# EAGLE design Precision LPC (EAGLE 6.2)
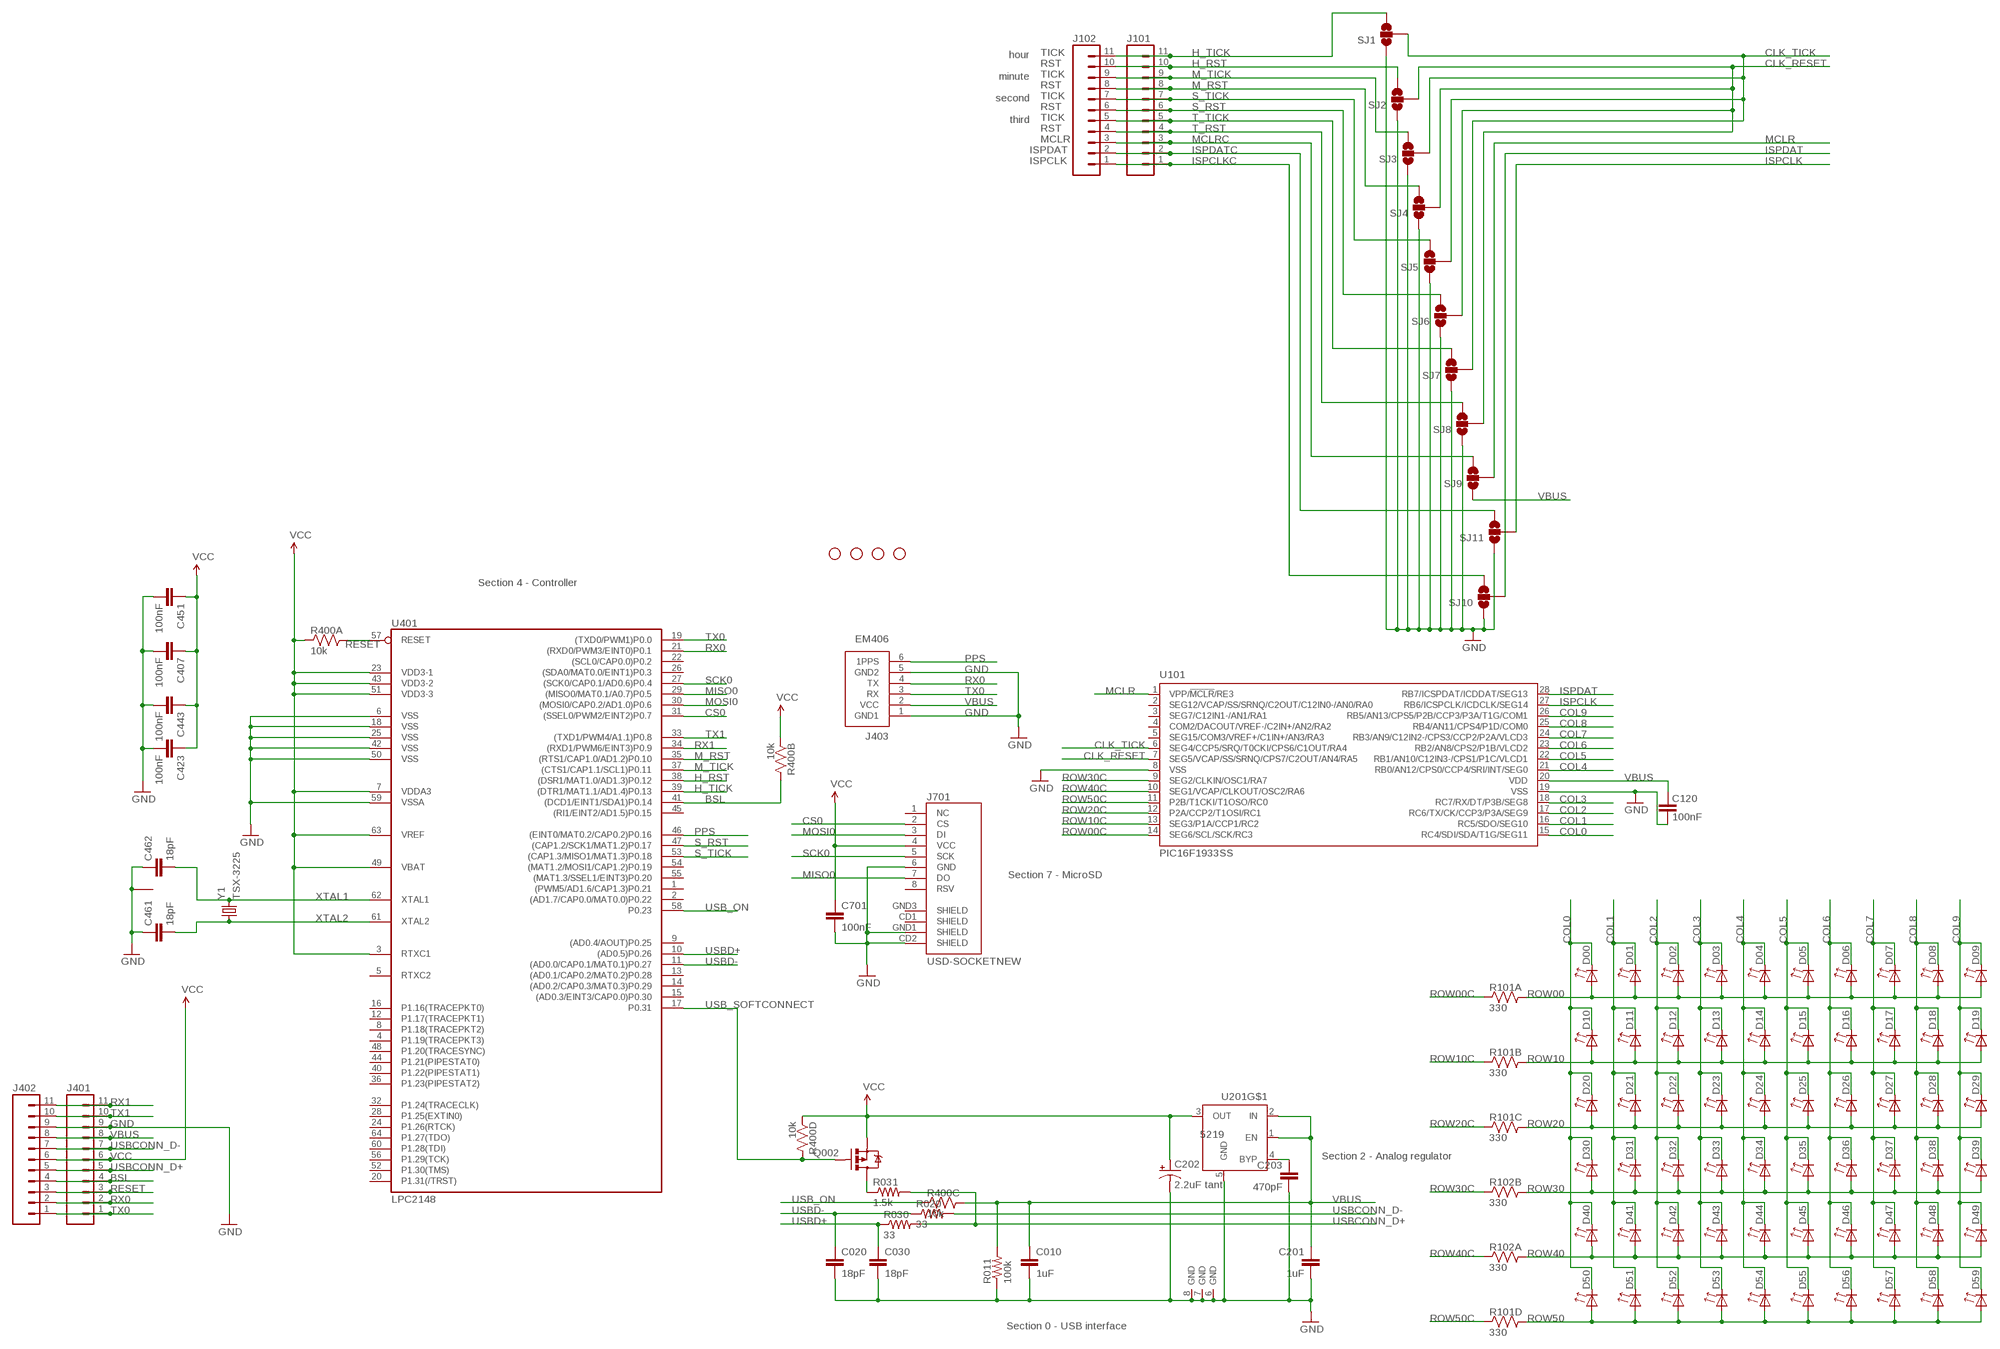
[diagram p0: schematic, sheet 1]

## Parts
C010  1uF  CAP0402-CAP  [0402-CAP]
C020  18pF  CAP0402-CAP  [0402-CAP]
C030  18pF  CAP0402-CAP  [0402-CAP]
C120  100nF  CAP0402-CAP  [0402-CAP]
C201  1uF  CAP0402-CAP  [0402-CAP]
C202  2.2uF tant  CAP_POL1206  [EIA3216]
C203  470pF  CAP0402-CAP  [0402-CAP]
C407  100nF  CAP0402-CAP  [0402-CAP]
C423  100nF  CAP0402-CAP  [0402-CAP]
C443  100nF  CAP0402-CAP  [0402-CAP]
C451  100nF  CAP0402-CAP  [0402-CAP]
C461  18pF  CAP0402-CAP  [0402-CAP]
C462  18pF  CAP0402-CAP  [0402-CAP]
C701  100nF  CAP0402-CAP  [0402-CAP]
D00  LED0603_SIDE  [LED0603_SIDE]
D01  LED0603_SIDE  [LED0603_SIDE]
D02  LED0603_SIDE  [LED0603_SIDE]
D03  LED0603_SIDE  [LED0603_SIDE]
D04  LED0603_SIDE  [LED0603_SIDE]
D05  LED0603_SIDE  [LED0603_SIDE]
D06  LED0603_SIDE  [LED0603_SIDE]
D07  LED0603_SIDE  [LED0603_SIDE]
D08  LED0603_SIDE  [LED0603_SIDE]
D09  LED0603_SIDE  [LED0603_SIDE]
D10  LED0603_SIDE  [LED0603_SIDE]
D11  LED0603_SIDE  [LED0603_SIDE]
D12  LED0603_SIDE  [LED0603_SIDE]
D13  LED0603_SIDE  [LED0603_SIDE]
D14  LED0603_SIDE  [LED0603_SIDE]
D15  LED0603_SIDE  [LED0603_SIDE]
D16  LED0603_SIDE  [LED0603_SIDE]
D17  LED0603_SIDE  [LED0603_SIDE]
D18  LED0603_SIDE  [LED0603_SIDE]
D19  LED0603_SIDE  [LED0603_SIDE]
D20  LED0603_SIDE  [LED0603_SIDE]
D21  LED0603_SIDE  [LED0603_SIDE]
D22  LED0603_SIDE  [LED0603_SIDE]
D23  LED0603_SIDE  [LED0603_SIDE]
D24  LED0603_SIDE  [LED0603_SIDE]
D25  LED0603_SIDE  [LED0603_SIDE]
D26  LED0603_SIDE  [LED0603_SIDE]
D27  LED0603_SIDE  [LED0603_SIDE]
D28  LED0603_SIDE  [LED0603_SIDE]
D29  LED0603_SIDE  [LED0603_SIDE]
D30  LED0603_SIDE  [LED0603_SIDE]
D31  LED0603_SIDE  [LED0603_SIDE]
D32  LED0603_SIDE  [LED0603_SIDE]
D33  LED0603_SIDE  [LED0603_SIDE]
D34  LED0603_SIDE  [LED0603_SIDE]
D35  LED0603_SIDE  [LED0603_SIDE]
D36  LED0603_SIDE  [LED0603_SIDE]
D37  LED0603_SIDE  [LED0603_SIDE]
D38  LED0603_SIDE  [LED0603_SIDE]
D39  LED0603_SIDE  [LED0603_SIDE]
D40  LED0603_SIDE  [LED0603_SIDE]
D41  LED0603_SIDE  [LED0603_SIDE]
D42  LED0603_SIDE  [LED0603_SIDE]
D43  LED0603_SIDE  [LED0603_SIDE]
D44  LED0603_SIDE  [LED0603_SIDE]
D45  LED0603_SIDE  [LED0603_SIDE]
D46  LED0603_SIDE  [LED0603_SIDE]
D47  LED0603_SIDE  [LED0603_SIDE]
D48  LED0603_SIDE  [LED0603_SIDE]
D49  LED0603_SIDE  [LED0603_SIDE]
D50  LED0603_SIDE  [LED0603_SIDE]
D51  LED0603_SIDE  [LED0603_SIDE]
D52  LED0603_SIDE  [LED0603_SIDE]
D53  LED0603_SIDE  [LED0603_SIDE]
D54  LED0603_SIDE  [LED0603_SIDE]
D55  LED0603_SIDE  [LED0603_SIDE]
D56  LED0603_SIDE  [LED0603_SIDE]
D57  LED0603_SIDE  [LED0603_SIDE]
D58  LED0603_SIDE  [LED0603_SIDE]
D59  LED0603_SIDE  [LED0603_SIDE]
J101  M11PTH  [1X11]
J102  M11PTH  [1X11]
J401  M11PTH  [1X11]
J402  M11PTH  [1X11]
J403  EM406  [EM406@1]
J701  USD-SOCKETNEW  [MICRO-SD-SOCKET-PP]
JP3  STAND-OFF  [STAND-OFF]
JP4  STAND-OFF  [STAND-OFF]
JP5  STAND-OFF  [STAND-OFF]
JP6  STAND-OFF  [STAND-OFF]
Q002  PMOS  MOSFET-PCHANNELSMD  [SOT23-3]
R011  100k  RESISTOR0402-RES  [0402-RES]
R020  33  RESISTOR0402-RES  [0402-RES]
R030  33  RESISTOR0402-RES  [0402-RES]
R031  1.5k  RESISTOR0402-RES  [0402-RES]
R101  330  RP404  [CRA04]
R102  330  RP404  [CRA04]
R400  10k  RP404  [CRA04]
SJ1  SOLDERJUMPER_2WAYS  [SJ_3]
SJ2  SOLDERJUMPER_2WAYS  [SJ_3]
SJ3  SOLDERJUMPER_2WAYS  [SJ_3]
SJ4  SOLDERJUMPER_2WAYS  [SJ_3]
SJ5  SOLDERJUMPER_2WAYS  [SJ_3]
SJ6  SOLDERJUMPER_2WAYS  [SJ_3]
SJ7  SOLDERJUMPER_2WAYS  [SJ_3]
SJ8  SOLDERJUMPER_2WAYS  [SJ_3]
SJ9  SOLDERJUMPER_2WAYS  [SJ_3]
SJ10  SOLDERJUMPER_2WAYS  [SJ_3]
SJ11  SOLDERJUMPER_2WAYS  [SJ_3]
U101  PIC16F1933SS  [SSOP28]
U201  5219  MIC5219FMM  [MSOP08]
U401  LPC2148  LPC213X  [SQFP-S-10X10-64]
Y1  TSX-3225  [CRYSTAL_SMD]

## Nets
BSL: J401.4 J402.4 R400.7 U401.41((DCD1/EINT1/SDA1)P0.14)
CLK_RESET: SJ2.2 SJ4.2 SJ6.2 SJ8.2 U101.7(SEG5/VCAP/SS/SRNQ/CPS7/C2OUT/AN4/RA5)
CLK_TICK: SJ1.2 SJ3.2 SJ5.2 SJ7.2 U101.6(SEG4/CCP5/SRQ/T0CKI/CPS6/C1OUT/RA4)
COL0: D00.C D10.C D20.C D30.C D40.C D50.C U101.15(RC4/SDI/SDA/T1G/SEG11)
COL1: D01.C D11.C D21.C D31.C D41.C D51.C U101.16(RC5/SDO/SEG10)
COL2: D02.C D12.C D22.C D32.C D42.C D52.C U101.17(RC6/TX/CK/CCP3/P3A/SEG9)
COL3: D03.C D13.C D23.C D33.C D43.C D53.C U101.18(RC7/RX/DT/P3B/SEG8)
COL4: D04.C D14.C D24.C D34.C D44.C D54.C U101.21(RB0/AN12/CPS0/CCP4/SRI/INT/SEG0)
COL5: D05.C D15.C D25.C D35.C D45.C D55.C U101.22(RB1/AN10/C12IN3-/CPS1/P1C/VLCD1)
COL6: D06.C D16.C D26.C D36.C D46.C D56.C U101.23(RB2/AN8/CPS2/P1B/VLCD2)
COL7: D07.C D17.C D27.C D37.C D47.C D57.C U101.24(RB3/AN9/C12IN2-/CPS3/CCP2/P2A/VLCD3)
COL8: D08.C D18.C D28.C D38.C D48.C D58.C U101.25(RB4/AN11/CPS4/P1D/COM0)
COL9: D09.C D19.C D29.C D39.C D49.C D59.C U101.26(RB5/AN13/CPS5/P2B/CCP3/P3A/T1G/COM1)
CS0: J701.2(CS) U401.31((SSEL0/PWM2/EINT2)P0.7)
GND [power]: C010.2 C020.2 C030.2 C120.1 C201.2 C202.C(-) C203.2 C407.2 C423.2 C443.2 C451.2 C461.1 C462.1 C701.2 J401.9 J402.9 J403.1(GND1) J403.5(GND2) J701.6(GND) J701.CD2(SHIELD) J701.GND1(SHIELD) R011.1 SJ1.1 SJ2.1 SJ3.1 SJ4.1 SJ5.1 SJ6.1 SJ7.1 SJ8.1 SJ10.1 SJ11.1 U101.8(VSS) U101.19(VSS) U201.5(GND) U201.6(GND) U201.7(GND) U201.8(GND) U401.6(VSS) U401.18(VSS) U401.25(VSS) U401.42(VSS) U401.50(VSS) U401.59(VSSA) Y1.2 Y1.4
H_RST: J101.10 J102.10 SJ2.3 U401.38((DSR1/MAT1.0/AD1.3)P0.12)
H_TICK: J101.11 J102.11 SJ1.3 U401.39((DTR1/MAT1.1/AD1.4)P0.13)
ISPCLK: SJ11.2 U101.27(RB6/ICSPCLK/ICDCLK/SEG14)
ISPCLKC: J101.2 J102.2 SJ11.3
ISPDAT: SJ10.2 U101.28(RB7/ICSPDAT/ICDDAT/SEG13)
ISPDATC: J101.1 J102.1 SJ10.3
M_RST: J101.8 J102.8 SJ4.3 U401.35((RTS1/CAP1.0/AD1.2)P0.10)
M_TICK: J101.9 J102.9 SJ3.3 U401.37((CTS1/CAP1.1/SCL1)P0.11)
MCLR: SJ9.2 U101.1(VPP/!MCLR!/RE3)
MCLRC: J101.3 J102.3 SJ9.3
MISO0: J701.7(DO) U401.29((MISO0/MAT0.1/A0.7)P0.5)
MOSI0: J701.3(DI) U401.30((MOSI0/CAP0.2/AD1.0)P0.6)
N$3: C203.1 U201.4(BYP)
PPS: J403.6(1PPS) U401.46((EINT0/MAT0.2/CAP0.2)P0.16)
QDRAIN: Q002.3(D) R031.1
RESET: J401.3 J402.3 R400.8 U401.57(RESET)
ROW00: D00.A D01.A D02.A D03.A D04.A D05.A D06.A D07.A D08.A D09.A R101.8
ROW00C: R101.1 U101.14(SEG6/SCL/SCK/RC3)
ROW10: D10.A D11.A D12.A D13.A D14.A D15.A D16.A D17.A D18.A D19.A R101.7
ROW10C: R101.2 U101.13(SEG3/P1A/CCP1/RC2)
ROW20: D20.A D21.A D22.A D23.A D24.A D25.A D26.A D27.A D28.A D29.A R101.6
ROW20C: R101.3 U101.12(P2A/CCP2/T1OSI/RC1)
ROW30: D30.A D31.A D32.A D33.A D34.A D35.A D36.A D37.A D38.A D39.A R102.7
ROW30C: R102.2 U101.9(SEG2/CLKIN/OSC1/RA7)
ROW40: D40.A D41.A D42.A D43.A D44.A D45.A D46.A D47.A D48.A D49.A R102.8
ROW40C: R102.1 U101.10(SEG1/VCAP/CLKOUT/OSC2/RA6)
ROW50: D50.A D51.A D52.A D53.A D54.A D55.A D56.A D57.A D58.A D59.A R101.5
ROW50C: R101.4 U101.11(P2B/T1CKI/T1OSO/RC0)
RX0: J401.2 J402.2 J403.4(TX) U401.21((RXD0/PWM3/EINT0)P0.1)
RX1: J401.11 J402.11 U401.34((RXD1/PWM6/EINT3)P0.9)
S_RST: J101.6 J102.6 SJ6.3 U401.47((CAP1.2/SCK1/MAT1.2)P0.17)
S_TICK: J101.7 J102.7 SJ5.3 U401.53((CAP1.3/MISO1/MAT1.3)P0.18)
SCK0: J701.5(SCK) U401.27((SCK0/CAP0.1/AD0.6)P0.4)
T_RST: J101.4 J102.4 SJ8.3
T_TICK: J101.5 J102.5 SJ7.3
TX0: J401.1 J402.1 J403.3(RX) U401.19((TXD0/PWM1)P0.0)
TX1: J401.10 J402.10 U401.33((TXD1/PWM4/A1.1)P0.8)
USB_ON: R400.3 U401.58(P0.23)
USB_SOFTCONNECT: Q002.1(G) R400.5 U401.17(P0.31)
USBCONN_D+: J401.5 J402.5 R030.2 R031.2
USBCONN_D-: J401.7 J402.7 R020.2
USBD+: C030.1 R030.1 U401.10((AD0.5)P0.26)
USBD-: C020.1 R020.1 U401.11((AD0.0/CAP0.1/MAT0.1)P0.27)
VBUS: C010.1 C120.2 C201.1 J401.8 J402.8 J403.2(VCC) R011.2 R400.6 SJ9.1 U101.20(VDD) U201.1(EN) U201.2(IN)
VCC [power]: C202.A(+) C407.1 C423.1 C443.1 C451.1 C701.1 J401.6 J402.6 J701.4(VCC) Q002.2(S) R400.1 R400.2 R400.4 U201.3(OUT) U401.3(RTXC1) U401.7(VDDA3) U401.23(VDD3-1) U401.43(VDD3-2) U401.49(VBAT) U401.51(VDD3-3) U401.63(VREF)
XTAL1: C462.2 U401.62(XTAL1) Y1.3
XTAL2: C461.2 U401.61(XTAL2) Y1.1
Unconnected: J701.1(NC) J701.8(RSV) J701.CD1(SHIELD) J701.GND3(SHIELD) R102.3 R102.4 R102.5 R102.6 U101.2(SEG12/VCAP/SS/SRNQ/C2OUT/C12IN0-/AN0/RA0) U101.3(SEG7/C12IN1-/AN1/RA1) U101.4(COM2/DACOUT/VREF-/C2IN+/AN2/RA2) U101.5(SEG15/COM3/VREF+/C1IN+/AN3/RA3) U401.1((PWM5/AD1.6/CAP1.3)P0.21) U401.2((AD1.7/CAP0.0/MAT0.0)P0.22) U401.4(P1.19(TRACEPKT3)) U401.5(RTXC2) U401.8(P1.18(TRACEPKT2)) U401.9((AD0.4/AOUT)P0.25) U401.12(P1.17(TRACEPKT1)) U401.13((AD0.1/CAP0.2/MAT0.2)P0.28) U401.14((AD0.2/CAP0.3/MAT0.3)P0.29) U401.15((AD0.3/EINT3/CAP0.0)P0.30) U401.16(P1.16(TRACEPKT0)) U401.20(P1.31(/TRST)) U401.22((SCL0/CAP0.0)P0.2) U401.24(P1.26(RTCK)) U401.26((SDA0/MAT0.0/EINT1)P0.3) U401.28(P1.25(EXTIN0)) U401.32(P1.24(TRACECLK)) U401.36(P1.23(PIPESTAT2)) U401.40(P1.22(PIPESTAT1)) U401.44(P1.21(PIPESTAT0)) U401.45((RI1/EINT2/AD1.5)P0.15) U401.48(P1.20(TRACESYNC)) U401.52(P1.30(TMS)) U401.54((MAT1.2/MOSI1/CAP1.2)P0.19) U401.55((MAT1.3/SSEL1/EINT3)P0.20) U401.56(P1.29(TCK)) U401.60(P1.28(TDI)) U401.64(P1.27(TDO))

## Notes on the sheet
- hour
- TICK
- RST
- minute
- TICK
- RST
- second
- TICK
- RST
- third
- TICK
- RST
- MCLR
- ISPDAT
- ISPCLK
- Section 4 - Controller
- Section 7 - MicroSD
- Section 2 - Analog regulator
- Section 0 - USB interface

## Library data of the parts
C010 C020 C030 C120 C201 C203 C407 C423 C443 C451 C461 C462 C701 = SparkFun:CAP: Capacitor Standard 0603 ceramic capacitor, and 0.1" leaded capacitor.
C202 = SparkFun:CAP_POL: Capacitor Polarized These are standard SMD and PTH capacitors. Normally 10uF, 47uF, and 100uF in electrolytic and tantalum varieties. Always verify the external diameter of the through hole cap, it varies with capacity, voltage, and manufacturer. The EIA devices should be standard.
D00 D01-D09 D10-D59 = KwanSystems:LED0603_SIDE
J101 J102 J401 J402 = SparkFun:M11: Header 11 Standard 11-pin 0.1" header. Use with straight break away headers (SKU : PRT-00116), right angle break away headers (PRT-00553), swiss pins (PRT-00743), machine pins (PRT-00117), and female headers (PRT-00115).
J403 = SparkFun:EM406: EM406 Connector Proven layout and schematic for EM406 connector. Spark Fun Electronics SKU : GPS-00579
J701 = SparkFun:USD-SOCKET: microSD Socket Push-push type uSD socket. Schematic element and footprint production proven. Spark Fun Electronics SKU : PRT-00127. tDoc lines correctly indicate media card edge positions when inserting (unlocked, locked, depressed).
JP3-JP6 = SparkFun:STAND-OFF: Stand Off This is the mechanical footprint for a #4 phillips button head screw. Use the keepout ring to avoid running the screw head into surrounding components. SKU : PRT-00447
Q002 = SparkFun:MOSFET-PCHANNEL
R011 R020 R030 R031 = SparkFun:RESISTOR: Resistor Basic schematic elements and footprints for 0603, 1206, and PTH resistors.
R101 R102 R400 = KwanSystems:RP4
SJ1-SJ11 = SparkFun:SOLDERJUMPER_2WAY: Solder Jumper 2 way solder jumper
U101 = microchip:PIC16F19*: Flash-Based, 8-Bit CMOS Microcontrollers wtih LCD Driver and nanoWatt XLP Technology Auto generated by make-symbol-device-package-bsdl.ulp Rev. 33 Source: http://ww1.microchip.com/downloads/en/DeviceDoc/41364D.pdf; MPN: PIC16F1933T-I/SS; OC_FARNELL: 1755815; OC_NEWARK: 08R1942
U201 = v-reg-micrel:MIC5219FMM: VOLTAGE REGULATOR; OC_FARNELL: unknown; OC_NEWARK: unknown
U401 = SparkFun:LPC213X: LPC213x Schematic element and footprint for NXP LPC213x. Spark Fun Electronics SKU : COM-00520
Y1 = KwanSystems:TSX-3225

## Net classes
0 default: width 0.152 mm, drill 0.33 mm, clearance 0.152 mm
1 power: width 0.152 mm, drill 0.33 mm, clearance 0.152 mm
2 hv: width 0.152 mm, drill 0.33 mm, clearance 0.152 mm

## Board
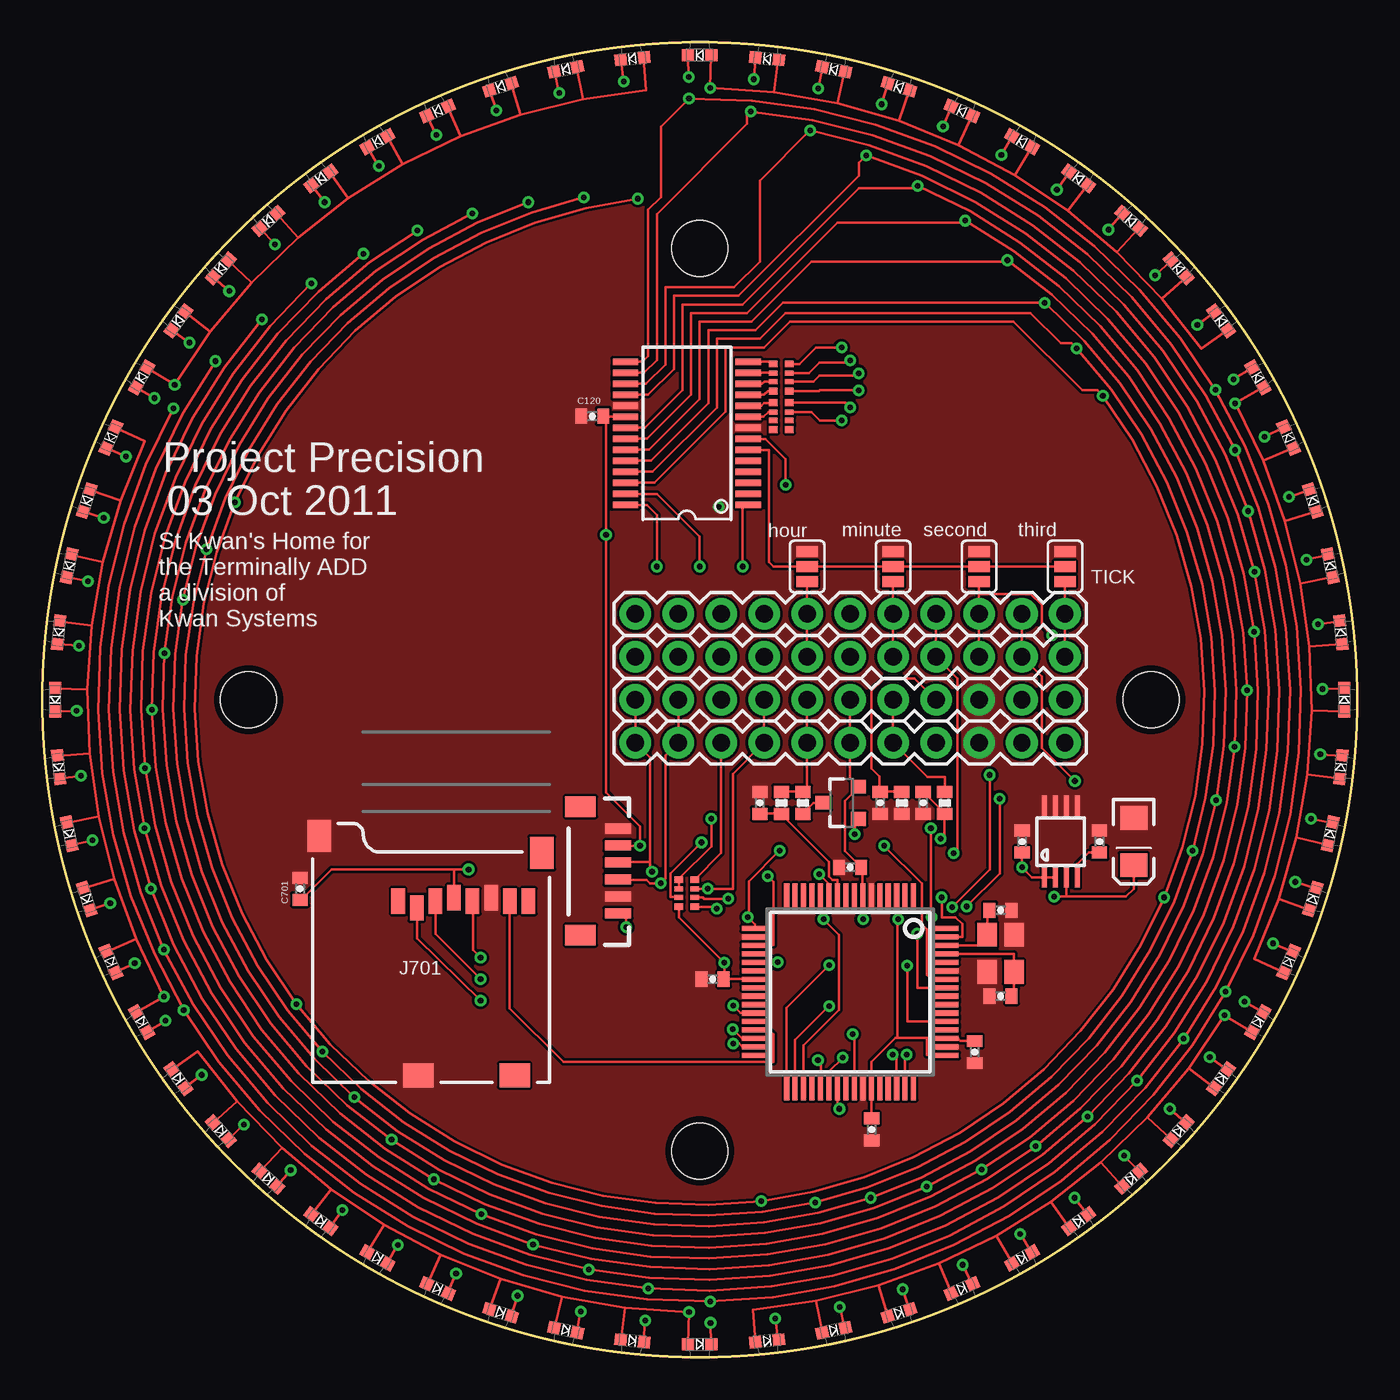
[diagram p1: board, top side]
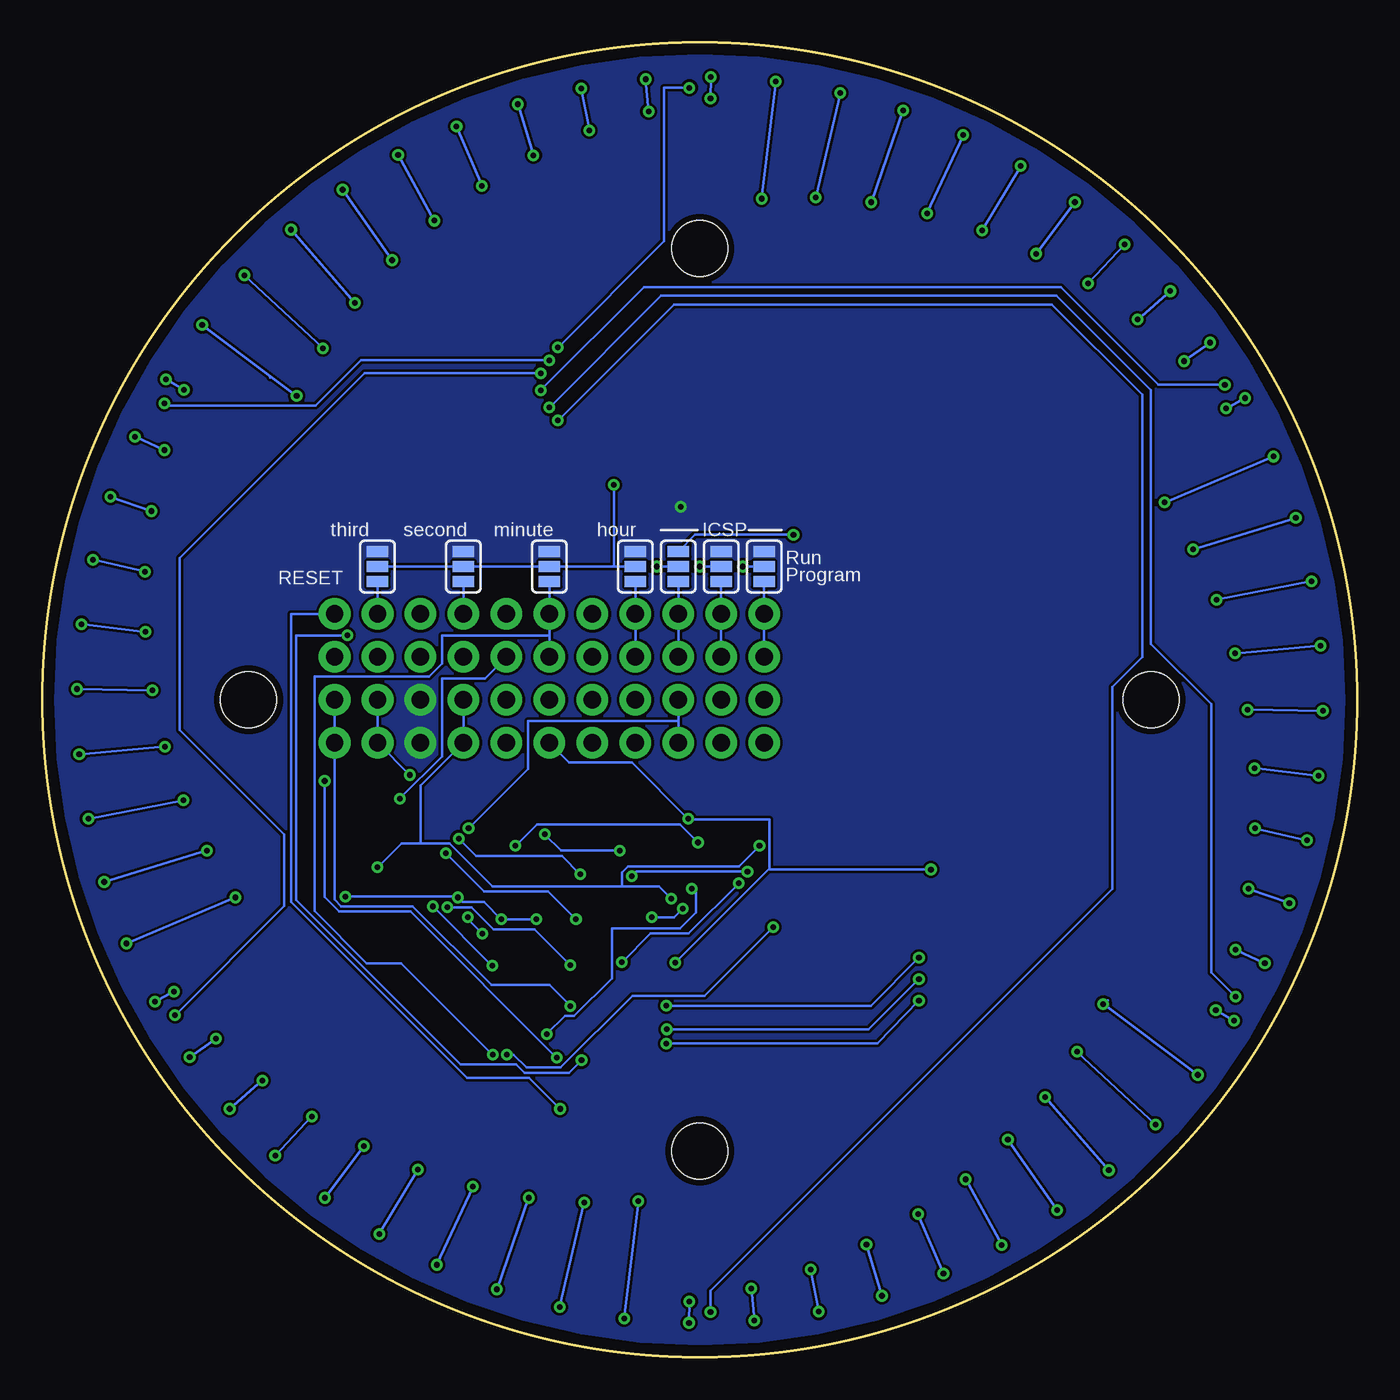
[diagram p2: board, bottom side, seen from below]

Size 77.72 x 77.72 mm. Coordinates in mm from the lower left corner, seen from the top.
Outline: circle at 38.86,38.86 radius 38.86
Copper layers (1*16): Top 0.0356mm / dielectric 1.5011mm / Bottom 0.0356mm
Design rules "LaenPCBOrder *": minimum track width 6mil, minimum drill 13mil, track to track 6mil, track to pad 6mil, pad to pad 6mil, via to via 6mil, smd to smd 6mil, copper to edge 15mil, drill to drill 6mil, minimum pad ring 7mil, minimum via ring 7mil, stop-mask expansion 4mil, vias tented up to drill 20mil, thermal gap 10mil

### Footprints (pad centres in the part's own frame; a part is rotated, then mirrored left to right if it is on the bottom)
0402-CAP = smd 0.7 x 0.9: 1 -0.65,0; 2 0.65,0
EIA3216 = smd 1.4 x 1.6: A 1.4,0; C -1.4,0
LED0603_SIDE = smd 0.7 x 0.7: A -0.7,0; C 0.7,0
1X11 = drill 1.016 pad 1.88 round: 1 0,0; 2 2.54,0; 3 5.08,0; 4 7.62,0; 5 10.16,0; 6 12.7,0; 7 15.24,0; 8 17.78,0; 9 20.32,0; 10 22.86,0; 11 25.4,0
EM406@1 = smd 0.6 x 1.55: 1 0,0; 2 1,0; 3 2,0; 4 3,0; 5 4,0; 6 5,0 | smd 1.2 x 1.8: P$1 -1.3,-2.225; P$2 6.3,-2.225
MICRO-SD-SOCKET-PP = smd 0.8 x 1.5: 1 -8.94,10.7; 2 -7.84,10.3; 3 -6.74,10.7; 4 -5.64,10.9; 5 -4.54,10.7; 6 -3.44,10.9; 7 -2.34,10.7; 8 -1.24,10.7 | smd 1.8 x 1.4: CD1 -2.05,0.4; CD2 -7.75,0.4 | smd 1.4 x 1.9: GND1 -13.6,14.55; GND3 -0.45,13.55
STAND-OFF = hole 3.302: 0,0
SOT23-3 = smd 0.8 x 0.9: 1 -0.95,-1; 2 0.95,-1; 3 0,1.1
0402-RES = smd 0.7 x 0.9: 1 -0.65,0; 2 0.65,0
CRA04 = smd 0.4 x 0.5: 1 -0.8,-0.475; 4 0.8,-0.475; 5 0.8,0.475; 8 -0.8,0.475 | smd 0.3 x 0.5: 2 -0.25,-0.475; 3 0.25,-0.475; 6 0.25,0.475; 7 -0.25,0.475
SJ_3 = smd 0.635 x 1.27: 1 -0.889,0; 2 0,0; 3 0.889,0
SSOP28 = smd 0.4 x 1.5: 1 -4.225,-3.625; 2 -3.575,-3.625; 3 -2.925,-3.625; 4 -2.275,-3.625; 5 -1.625,-3.625; 6 -0.975,-3.625; 7 -0.325,-3.625; 8 0.325,-3.625; 9 0.975,-3.625; 10 1.625,-3.625; 11 2.275,-3.625; 12 2.925,-3.625; 13 3.575,-3.625; 14 4.225,-3.625; 15 4.225,3.625; 16 3.575,3.625; 17 2.925,3.625; 18 2.275,3.625; 19 1.625,3.625; 20 0.975,3.625; 21 0.325,3.625; 22 -0.325,3.625; 23 -0.975,3.625; 24 -1.625,3.625; 25 -2.275,3.625; 26 -2.925,3.625; 27 -3.575,3.625; 28 -4.225,3.625
MSOP08 = smd 0.3 x 1.2: 1 -0.976,-2.113; 2 -0.326,-2.113; 3 0.324,-2.113; 4 0.974,-2.113; 5 0.974,2.112; 6 0.324,2.112; 7 -0.326,2.112; 8 -0.976,2.112
SQFP-S-10X10-64 = smd 0.3 x 1.6: 1 -3.75,-5.6; 2 -3.25,-5.6; 3 -2.75,-5.6; 4 -2.25,-5.6; 5 -1.75,-5.6; 6 -1.25,-5.6; 7 -0.75,-5.6; 8 -0.25,-5.6; 9 0.25,-5.6; 10 0.75,-5.6; 11 1.25,-5.6; 12 1.75,-5.6; 13 2.25,-5.6; 14 2.75,-5.6; 15 3.25,-5.6; 16 3.75,-5.6; 33 3.75,5.6; 34 3.25,5.6; 35 2.75,5.6; 36 2.25,5.6; 37 1.75,5.6; 38 1.25,5.6; 39 0.75,5.6; 40 0.25,5.6; 41 -0.25,5.6; 42 -0.75,5.6; 43 -1.25,5.6; 44 -1.75,5.6; 45 -2.25,5.6; 46 -2.75,5.6; 47 -3.25,5.6; 48 -3.75,5.6 | smd 1.6 x 0.3: 17 5.6,-3.75; 18 5.6,-3.25; 19 5.6,-2.75; 20 5.6,-2.25; 21 5.6,-1.75; 22 5.6,-1.25; 23 5.6,-0.75; 24 5.6,-0.25; 25 5.6,0.25; 26 5.6,0.75; 27 5.6,1.25; 28 5.6,1.75; 29 5.6,2.25; 30 5.6,2.75; 31 5.6,3.25; 32 5.6,3.75; 49 -5.6,3.75; 50 -5.6,3.25; 51 -5.6,2.75; 52 -5.6,2.25; 53 -5.6,1.75; 54 -5.6,1.25; 55 -5.6,0.75; 56 -5.6,0.25; 57 -5.6,-0.25; 58 -5.6,-0.75; 59 -5.6,-1.25; 60 -5.6,-1.75; 61 -5.6,-2.25; 62 -5.6,-2.75; 63 -5.6,-3.25; 64 -5.6,-3.75
CRYSTAL_SMD = smd 1.4 x 1.15: 1 -1.1,-0.8; 2 1.1,-0.8; 3 1.1,0.8; 4 -1.1,0.8

### Placement (x,y rotation side)
C010  49.53,32.77 270 top
C020  52.07,32.77 270 top
C030  42.42,32.77 90 top
C120  32.51,55.63 0 top
C201  57.91,30.48 90 top
C202  64.52,30.48 270 top
C203  62.48,30.48 90 top
C407  47.75,28.96 180 top
C423  39.62,22.35 180 top
C443  49.02,13.46 270 top
C451  55.12,18.03 270 top
C461  56.64,21.34 0 top
C462  56.64,26.42 180 top
C701  15.24,27.69 90 top
D00  38.86,76.96 180 top
D01  42.84,76.75 174 top
D02  46.78,76.13 168 top
D03  50.63,75.1 162 top
D04  54.36,73.67 156 top
D05  57.91,71.86 150 top
D06  61.26,69.68 144 top
D07  64.36,67.18 138 top
D08  67.18,64.36 132 top
D09  69.68,61.26 126 top
D10  71.86,57.91 120 top
D11  73.67,54.36 114 top
D12  75.1,50.63 108 top
D13  76.13,46.78 102 top
D14  76.75,42.84 96 top
D15  76.96,38.86 90 top
D16  76.75,34.88 84 top
D17  76.13,30.94 78 top
D18  75.1,27.09 72 top
D19  73.67,23.37 66 top
D20  71.86,19.81 60 top
D21  69.68,16.47 54 top
D22  67.18,13.37 48 top
D23  64.36,10.55 42 top
D24  61.26,8.04 36 top
D25  57.91,5.87 30 top
D26  54.36,4.06 24 top
D27  50.63,2.63 18 top
D28  46.78,1.6 12 top
D29  42.84,0.97 6 top
D30  38.86,0.76 0 top
D31  34.88,0.97 354 top
D32  30.94,1.6 348 top
D33  27.09,2.63 342 top
D34  23.37,4.06 336 top
D35  19.81,5.87 330 top
D36  16.47,8.04 324 top
D37  13.37,10.55 318 top
D38  10.55,13.37 312 top
D39  8.04,16.47 306 top
D40  5.87,19.81 300 top
D41  4.06,23.37 294 top
D42  2.63,27.09 288 top
D43  1.6,30.94 282 top
D44  0.97,34.88 276 top
D45  0.76,38.86 270 top
D46  0.97,42.84 264 top
D47  1.6,46.78 258 top
D48  2.63,50.63 252 top
D49  4.06,54.36 246 top
D50  5.87,57.91 240 top
D51  8.04,61.26 234 top
D52  10.55,64.36 228 top
D53  13.37,67.18 222 top
D54  16.47,69.68 216 top
D55  19.81,71.86 210 top
D56  23.37,73.67 204 top
D57  27.09,75.1 198 top
D58  30.94,76.13 192 top
D59  34.88,76.75 186 top
J101  35.05,43.94 0 top
J102  35.05,41.4 0 top
J401  35.05,36.32 0 top
J402  35.05,38.86 0 top
J403  34.04,31.24 270 top
J701  29.97,16.26 0 top
JP3  65.53,38.86 0 top
JP4  38.86,65.53 0 top
JP5  12.19,38.86 0 top
JP6  38.86,12.19 0 top
Q002  47.24,32.77 90 top
R011  50.8,32.77 90 top
R020  53.34,32.77 90 top
R030  43.69,32.77 90 top
R031  44.96,32.77 90 top
R101  43.69,57.91 270 top
R102  43.69,55.63 270 top
R400  38.1,27.43 270 top
SJ1  60.45,46.74 270 top
SJ2  57.91,46.74 270 bottom
SJ3  55.37,46.74 270 top
SJ4  52.83,46.74 270 bottom
SJ5  50.29,46.74 270 top
SJ6  47.75,46.74 270 bottom
SJ7  45.21,46.74 270 top
SJ8  42.67,46.74 270 bottom
SJ9  40.13,46.74 270 bottom
SJ10  35.05,46.74 270 bottom
SJ11  37.59,46.74 270 bottom
U101  38.1,54.61 90 top
U201  60.2,30.48 0 top
U401  47.75,21.59 180 top
Y1  56.64,23.88 90 top

### Tracks (layer width: path | path; a pad name or v marks a point on that pad's centre or on a via)
BSL  (via drill 0.33)
  Top 0.152: R400.7 v39.34,27.69 40.82,27.69 40.82,34.47 J401.4 J402.4 | 47.98,16 U401.41 48,19 v47.9,19.1
  Bottom 0.152: v47.9,19.1 46.84,20.17 46.28,20.17 44.04,22.4 44.04,25.35 40.03,25.35 39.09,26.29 39.09,27.69 v39.34,27.69
CLK_RESET  (via drill 0.33)
  Top 0.152: U101.7 42.75,54.28 43.94,53.09 v43.94,51.56
  Bottom 0.152: SJ2.2 SJ4.2 SJ6.2 43.94,46.74 | SJ8.2 43.94,46.74 | 43.94,46.74 v43.94,51.56
CLK_TICK
  Top 0.152: SJ1.2 SJ3.2 50.8,46.74 50.75,46.79 50.34,46.79 SJ5.2 SJ7.2 43.2,46.74 42.95,46.99 42.95,53.62 41.73,53.62 U101.6
COL0  (via drill 0.33)
  Top 0.152: v38.2,75.67 38.18,76.94 38.18,76.96 D00.C | v70.41,57.81 71.5,58.47 71.53,58.52 D10.C | v71.07,21.01 72.16,20.37 D20.C | v39.5,2.03 39.52,0.76 D30.C | 6.21,19.23 v7.29,19.89 | 6.21,19.23 6.2,19.23 | v7.75,56.08 6.12,52.76 4.85,49.25 3.94,45.64 3.43,41.96 3.3,38.23 3.56,34.52 4.19,30.86 5.23,27.28 6.63,23.83 v8.36,20.52 10.44,17.45 12.85,14.61 15.52,12.01 18.44,9.73 21.62,7.75 24.94,6.12 28.45,4.85 32.05,3.94 35.74,3.43 v39.47,3.3 43.18,3.56 46.84,4.19 50.42,5.23 53.87,6.63 57.18,8.36 60.25,10.44 63.09,12.85 65.68,15.52 67.97,18.44 v69.95,21.62 71.58,24.94 72.85,28.45 73.76,32.05 74.27,35.74 74.4,39.47 74.14,43.18 73.51,46.84 72.47,50.42 71.07,53.87 v69.34,57.18 67.26,60.25 64.85,63.09 62.18,65.68 59.26,67.97 56.08,69.95 52.76,71.58 49.25,72.85 45.64,73.76 41.96,74.27 v38.23,74.4 36.58,72.75 36.58,68.58 35.81,67.82 35.81,59.18 35.47,58.84 U101.15 | v6.63,56.69 5.55,57.32 | 5.55,57.32 5.54,57.33 | D40.C 6.21,19.23 | D50.C 5.54,57.3 5.55,57.32
  Bottom 0.152: v38.23,74.4 v38.2,75.67 | v69.34,57.18 v70.41,57.81 | v69.95,21.62 v71.07,21.01 | v39.47,3.3 v39.5,2.03 | v7.29,19.89 v8.36,20.52 | v7.75,56.08 v6.63,56.69
COL1  (via drill 0.33)
  Top 0.152: v42.06,75.54 42.16,76.81 42.16,76.84 D01.C | v72.24,54.41 73.38,54.94 73.41,54.99 D11.C | v69.01,17.73 70.05,16.99 70.1,17.04 D21.C | v35.64,2.16 35.54,0.92 | 35.54,0.92 35.54,0.89 | 4.33,22.76 v5.46,23.29 | 4.33,22.76 4.32,22.76 | v10.24,58.88 8.31,55.78 6.71,52.5 5.46,49.07 4.57,45.52 4.06,41.88 3.94,38.25 4.19,34.59 4.83,30.99 5.82,27.48 v7.19,24.08 8.92,20.85 10.95,17.83 13.31,15.04 15.93,12.5 18.82,10.24 21.92,8.31 25.2,6.71 28.63,5.46 32.18,4.57 v35.81,4.06 39.45,3.94 43.1,4.19 46.71,4.83 50.22,5.82 53.62,7.19 56.84,8.92 59.87,10.95 62.66,13.31 65.2,15.93 v67.46,18.82 69.39,21.92 70.99,25.2 72.24,28.63 73.13,32.18 73.63,35.81 73.76,39.45 73.51,43.1 72.87,46.71 71.88,50.22 v70.51,53.62 68.78,56.84 66.75,59.87 64.39,62.66 61.77,65.2 58.88,67.46 55.78,69.39 52.5,70.99 49.07,72.24 45.52,73.13 v41.88,73.63 41.66,73.41 41.66,72.9 36.32,67.56 36.32,58.93 35.58,58.19 U101.16 | v8.69,59.97 7.65,60.71 D51.C | D41.C 4.33,22.76 | 35.54,0.92 35.56,0.91 D31.C
  Bottom 0.152: v41.88,73.63 v42.06,75.54 | v70.51,53.62 v72.24,54.41 | v67.46,18.82 v69.01,17.73 | v35.81,4.06 v35.64,2.16 | v5.46,23.29 v7.19,24.08 | v10.24,58.88 v8.69,59.97
COL2  (via drill 0.33)
  Top 0.152: v45.87,75.01 46.13,76.25 D02.C | v45.39,72.52 48.87,71.65 52.25,70.41 55.47,68.83 58.52,66.93 61.34,64.72 63.93,62.23 66.24,59.49 68.25,56.52 69.93,53.34 v71.27,50.01 72.26,46.56 72.87,43.03 73.13,39.45 73,35.87 72.52,32.31 71.65,28.83 70.41,25.45 68.83,22.23 66.93,19.18 v64.72,16.36 62.23,13.77 59.49,11.46 56.52,9.45 53.34,7.77 50.01,6.43 46.56,5.44 43.03,4.83 39.45,4.57 35.87,4.7 v32.31,5.18 28.83,6.05 25.45,7.29 22.23,8.87 19.18,10.77 16.36,12.98 13.77,15.47 11.46,18.21 9.45,21.18 7.77,24.36 v6.43,27.69 5.44,31.14 4.83,34.67 4.57,38.25 4.7,41.83 5.18,45.39 6.05,48.87 7.29,52.25 8.87,55.47 10.77,58.52 v12.98,61.34 | v73.69,50.85 74.88,51.26 D12.C | v66.65,14.68 67.6,13.85 | 67.6,13.85 67.62,13.84 | v31.83,2.69 31.58,1.48 | 31.58,1.48 31.57,1.45 | 2.83,26.45 2.82,26.44 | 2.83,26.45 v4.01,26.85 | v11.05,63.02 10.1,63.85 | 10.1,63.85 10.08,63.86 | U101.17 35.69,57.54 36.83,58.67 36.83,63.25 40.89,63.25 42.42,64.77 42.42,69.54 v45.39,72.52 | v45.39,72.52 45.26,72.39 | D42.C 2.83,26.45 | 31.58,1.48 31.62,1.47 D32.C | D52.C 10.1,63.85 | D22.C 67.6,13.85
  Bottom 0.152: v45.39,72.52 v45.87,75.01 | v71.27,50.01 v73.69,50.85 | v64.72,16.36 v66.65,14.68 | v32.31,5.18 v31.83,2.69 | v4.01,26.85 v6.43,27.69 | v12.98,61.34 v11.05,63.02
COL3  (via drill 0.33)
  Top 0.152: v49.61,74.07 49.99,75.29 D03.C | v74.73,47.14 75.97,47.42 76,47.47 D13.C 75.69,47.75 | v63.96,11.91 64.82,10.98 | 64.82,10.98 64.82,10.97 | 27.72,2.43 v28.09,3.63 | 27.72,2.43 27.71,2.41 | v2.97,30.56 1.75,30.28 | 1.75,30.28 1.73,30.28 | v15.9,63.48 13.46,60.94 11.28,58.14 9.42,55.17 7.87,51.99 6.66,48.69 5.82,45.26 5.33,41.78 5.21,38.25 5.44,34.75 v6.05,31.27 7.04,27.89 8.36,24.64 10.01,21.51 11.96,18.59 14.22,15.9 16.76,13.46 19.56,11.28 22.53,9.42 25.71,7.87 v29.01,6.66 32.44,5.82 35.92,5.33 39.45,5.21 42.95,5.44 46.43,6.05 49.81,7.04 53.06,8.36 56.19,10.01 59.11,11.96 v61.8,14.22 64.24,16.76 66.42,19.56 68.28,22.53 69.82,25.71 71.04,29.01 71.88,32.44 72.37,35.92 72.49,39.45 72.26,42.95 v71.65,46.43 70.66,49.81 69.34,53.06 67.69,56.19 65.74,59.11 63.48,61.8 60.94,64.24 58.14,66.42 55.17,68.28 51.99,69.82 v48.69,71.04 48.26,70.61 48.26,69.85 41.15,62.74 37.34,62.74 37.34,58.42 35.8,56.88 U101.18 | v13.74,65.79 12.88,66.72 | 12.88,66.72 12.88,66.73 | D33.C 27.72,2.43 | 1.75,30.28 D43.C | D53.C 12.85,66.7 12.88,66.72 | D23.C 64.87,11.02 64.82,10.98
  Bottom 0.152: v48.69,71.04 v49.61,74.07 | v74.73,47.14 v71.65,46.43 71.88,46.48 | v61.8,14.22 v63.96,11.91 | v28.09,3.63 v29.01,6.66 | v2.97,30.56 v6.05,31.27 5.84,31.24 | v15.9,63.48 v13.74,65.79
COL4  (via drill 0.33)
  Top 0.152: v53.24,72.75 53.75,73.91 53.72,73.97 D04.C | v75.41,43.33 76.66,43.48 D14.C | v61.01,9.42 61.77,8.43 61.72,8.38 D24.C | 23.96,3.81 v24.46,4.95 | 23.96,3.81 23.95,3.79 | v2.29,34.37 1.06,34.22 | 1.06,34.22 1.04,34.21 | v18.97,65.23 16.33,62.99 13.92,60.5 11.81,57.79 9.96,54.86 8.46,51.74 7.26,48.51 6.43,45.16 5.94,41.73 5.84,38.28 v6.07,34.82 6.68,31.42 7.62,28.09 8.92,24.89 10.54,21.84 12.47,18.97 14.71,16.33 17.2,13.92 19.91,11.81 22.84,9.96 v25.96,8.46 29.19,7.26 32.54,6.43 35.97,5.94 39.42,5.84 42.88,6.07 46.28,6.68 49.61,7.62 52.81,8.92 55.86,10.54 v58.73,12.47 61.37,14.71 63.78,17.2 65.89,19.91 67.74,22.84 69.24,25.96 70.43,29.19 71.27,32.54 71.75,35.97 71.86,39.42 v71.63,42.88 71.02,46.28 70.08,49.61 68.78,52.81 67.16,55.86 65.23,58.73 62.99,61.37 60.5,63.78 57.79,65.89 54.86,67.74 v51.74,69.24 51.59,69.09 48.26,69.09 41.4,62.23 37.85,62.23 37.85,57.15 35.63,54.94 U101.21 | v16.69,68.28 15.93,69.27 15.9,69.29 D54.C 16,69.34 | D34.C 24.03,3.79 23.96,3.81 | 1.06,34.22 1.07,34.19 D44.C
  Bottom 0.152: v51.74,69.24 v53.24,72.75 | v71.63,42.88 v75.41,43.33 | v58.73,12.47 v61.01,9.42 | v24.46,4.95 v25.96,8.46 | v6.07,34.82 v2.29,34.37 | v18.97,65.23 v16.69,68.28
COL5  (via drill 0.33)
  Top 0.152: v56.69,71.07 57.33,72.16 57.33,72.21 D05.C | v75.67,39.5 76.94,39.52 D15.C | v57.81,7.29 58.47,6.21 | 58.47,6.21 58.47,6.2 | 20.37,5.54 | 20.37,5.54 v21.01,6.63 | v2.03,38.2 0.76,38.18 D45.C | v22.17,66.6 19.36,64.72 16.76,62.54 14.4,60.1 12.32,57.43 10.52,54.56 9.04,51.51 7.87,48.31 7.06,45.03 6.58,41.68 v6.48,38.28 6.71,34.9 7.29,31.57 8.23,28.3 9.5,25.17 11.1,22.17 12.98,19.36 15.16,16.76 17.6,14.4 20.27,12.32 v23.14,10.52 26.19,9.04 29.39,7.87 32.66,7.06 36.02,6.58 39.42,6.48 42.8,6.71 46.13,7.29 49.4,8.23 52.53,9.5 v55.52,11.1 58.34,12.98 60.94,15.16 63.3,17.6 65.38,20.27 67.18,23.14 68.66,26.19 69.82,29.39 70.64,32.66 71.12,36.02 v71.22,39.42 70.99,42.8 70.41,46.13 69.47,49.4 68.2,52.53 66.6,55.52 64.72,58.34 62.54,60.94 60.1,63.3 57.43,65.38 v54.56,67.18 54.43,67.06 46.99,67.06 41.66,61.72 38.35,61.72 38.35,56.9 35.74,54.29 U101.22 | v19.89,70.41 19.23,71.5 D55.C | D35.C 20.37,5.54 | 58.47,6.21 58.5,6.22 D25.C
  Bottom 0.152: v54.56,67.18 v56.69,71.07 | v71.22,39.42 v75.67,39.5 | v55.52,11.1 v57.81,7.29 | v21.01,6.63 v23.14,10.52 | v6.48,38.28 v2.03,38.2 | v22.17,66.6 v19.89,70.41
COL6  (via drill 0.33)
  Top 0.152: v59.97,69.01 60.71,70.05 60.71,70.1 D06.C | v75.54,35.64 76.81,35.54 76.84,35.59 D16.C | v54.41,5.46 54.94,4.32 | 54.94,4.32 | 17.01,7.67 16.99,7.65 | 17.01,7.67 v17.73,8.69 | v2.16,42.06 0.91,42.16 | 0.91,42.16 0.89,42.16 | v25.43,67.62 22.5,66.06 19.74,64.21 17.2,62.08 14.88,59.69 12.85,57.05 11.07,54.25 9.63,51.26 8.48,48.13 7.67,44.91 v7.21,41.61 7.11,38.3 7.34,34.98 7.93,31.7 8.84,28.52 10.08,25.43 11.63,22.5 13.49,19.74 15.62,17.2 18.01,14.88 v20.65,12.85 23.44,11.07 26.44,9.63 29.57,8.48 32.79,7.67 36.09,7.21 39.4,7.11 42.72,7.34 46,7.93 49.17,8.84 v52.27,10.08 55.19,11.63 57.96,13.49 60.5,15.62 62.81,18.01 64.85,20.65 66.62,23.44 68.07,26.44 69.22,29.57 70.03,32.79 v70.49,36.09 70.59,39.4 70.36,42.72 69.77,46 68.86,49.17 67.62,52.27 66.06,55.19 64.21,57.96 62.08,60.5 59.69,62.81 v57.05,64.85 56.97,64.77 45.47,64.77 41.91,61.21 38.86,61.21 38.86,56.64 35.86,53.63 U101.23 | v23.29,72.24 22.76,73.38 D56.C | D36.C 17.04,7.65 17.01,7.67 | 54.94,4.32 54.99,4.34 D26.C | D46.C 0.91,42.16
  Bottom 0.152: v57.05,64.85 v59.97,69.01 | v70.49,36.09 v75.54,35.64 | v52.27,10.08 v54.41,5.46 | v17.73,8.69 v20.65,12.85 | v7.21,41.61 v2.16,42.06 | v25.43,67.62 v23.29,72.24
COL7  (via drill 0.33)
  Top 0.152: v63.02,66.65 63.86,67.62 D07.C | v75.01,31.83 76.25,31.57 D17.C | v50.85,4.01 51.25,2.83 | 51.25,2.83 51.26,2.82 | 13.87,10.11 13.84,10.08 | 13.87,10.11 v14.68,11.05 | v2.69,45.87 1.45,46.12 | 1.45,46.12 1.45,46.13 | v28.73,68.28 25.71,67.06 22.84,65.53 20.12,63.7 17.63,61.59 15.37,59.26 13.36,56.69 11.63,53.92 10.21,51 9.09,47.95 v8.31,44.78 7.85,41.55 7.75,38.3 7.98,35.05 8.53,31.85 9.42,28.73 10.64,25.71 12.17,22.84 14,20.12 16.1,17.63 v18.44,15.37 21.01,13.36 23.77,11.63 26.7,10.21 29.74,9.09 32.92,8.31 36.14,7.85 39.4,7.75 42.65,7.98 45.85,8.53 v48.97,9.42 51.99,10.64 54.86,12.17 57.58,14 60.07,16.1 62.33,18.44 64.34,21.01 66.06,23.77 67.49,26.7 68.6,29.74 v69.39,32.92 69.85,36.14 69.95,39.4 69.72,42.65 69.16,45.85 68.28,48.97 67.06,51.99 65.53,54.86 63.7,57.58 61.59,60.07 v59.26,62.33 43.79,62.33 42.16,60.71 39.37,60.71 39.37,56.39 35.97,52.98 U101.24 | v26.85,73.69 26.44,74.88 D57.C | D37.C 13.87,10.11 | 51.25,2.83 51.28,2.85 D27.C | D47.C 1.45,46.12
  Bottom 0.152: v59.26,62.33 v63.02,66.65 | v69.39,32.92 v75.01,31.83 | v48.97,9.42 v50.85,4.01 | v14.68,11.05 v18.44,15.37 | v8.31,44.78 v2.69,45.87 | v28.73,68.28 v26.85,73.69
COL8  (via drill 0.33)
  Top 0.152: v65.79,63.96 66.73,64.82 66.7,64.87 D08.C | v74.07,28.09 75.29,27.71 D18.C | v47.14,2.97 47.42,1.75 | 47.42,1.75 47.42,1.73 | 10.99,12.89 10.97,12.88 | 10.99,12.89 v11.91,13.74 | v3.63,49.61 2.42,49.98 | 2.42,49.98 2.41,49.99 | v32,68.56 28.93,67.67 25.96,66.47 23.14,64.97 20.5,63.2 18.06,61.14 15.85,58.85 13.89,56.34 12.19,53.62 10.8,50.75 v9.7,47.75 8.94,44.65 8.48,41.5 8.38,38.33 8.59,35.13 9.14,32 10.03,28.93 11.23,25.96 12.73,23.14 14.5,20.5 v16.56,18.06 18.85,15.85 21.36,13.89 24.08,12.19 26.95,10.8 29.95,9.7 33.05,8.94 36.2,8.48 39.37,8.38 42.57,8.59 v45.7,9.14 48.77,10.03 51.74,11.23 54.56,12.73 57.2,14.5 59.64,16.56 61.85,18.85 63.8,21.36 65.51,24.08 66.9,26.95 v68,29.95 68.76,33.05 69.22,36.2 69.32,39.37 69.11,42.57 68.56,45.7 67.67,48.77 66.47,51.74 64.97,54.56 63.2,57.2 v61.14,59.64 60.83,59.94 60.2,59.94 58.42,61.72 43.94,61.72 42.42,60.2 39.88,60.2 39.88,56.13 36.08,52.34 U101.25 | v30.56,74.73 30.28,75.97 30.25,76 D58.C | D38.C 11.02,12.85 10.99,12.89 | 47.42,1.75 47.45,1.75 D28.C | D48.C 2.42,49.98
  Bottom 0.152: v61.14,59.64 v65.79,63.96 | v68,29.95 v74.07,28.09 | v45.7,9.14 v47.14,2.97 | v11.91,13.74 v16.56,18.06 | v9.7,47.75 v3.63,49.61 | v32,68.56 v30.56,74.73
COL9  (via drill 0.33)
  Top 0.152: v68.28,61.01 69.27,61.77 69.29,61.82 D09.C 69.34,61.72 | v72.75,24.46 73.91,23.95 73.97,24 D19.C | v43.33,2.29 43.48,1.04 43.56,1.04 D29.C | 8.49,15.97 8.43,15.93 | 8.49,15.97 v9.42,16.69 | v4.95,53.24 3.79,53.74 | 3.79,53.74 3.79,53.75 | v35.2,68.48 32.13,67.92 29.13,67.06 26.24,65.89 23.47,64.44 20.88,62.69 18.49,60.68 16.33,58.42 14.4,55.96 12.75,53.32 v11.38,50.52 10.31,47.57 9.55,44.55 9.12,41.45 9.02,38.33 9.22,35.2 9.78,32.13 10.64,29.13 11.81,26.24 13.26,23.47 v15.01,20.88 17.02,18.49 19.28,16.33 21.74,14.4 24.38,12.75 27.18,11.38 30.12,10.31 33.15,9.55 36.25,9.12 39.37,9.02 v42.49,9.22 45.57,9.78 48.57,10.64 51.46,11.81 54.23,13.26 56.82,15.01 59.21,17.02 61.37,19.28 63.3,21.74 64.95,24.38 v66.32,27.18 67.39,30.12 68.15,33.15 68.58,36.25 68.68,39.37 68.48,42.49 67.92,45.57 67.06,48.57 65.89,51.46 64.44,54.23 v62.69,56.82 62.36,57.15 61.47,57.15 57.4,61.21 44.2,61.21 42.67,59.69 40.39,59.69 40.39,55.88 36.19,51.69 U101.26 | v34.37,75.41 34.21,76.66 D59.C | 8.38,16 D39.C 8.46,16 8.49,15.97 | D49.C 3.79,53.72 3.79,53.74
  Bottom 0.152: v62.69,56.82 64.22,57.97 | 64.22,57.97 v68.28,61.01 | v66.32,27.18 v72.75,24.46 | v42.49,9.22 v43.33,2.29 | v9.42,16.69 v15.01,20.88 14.73,21.08 | v11.38,50.52 v4.95,53.24 | v35.2,68.48 v34.37,75.41 | 64.22,57.97 64.26,57.91
CS0  (via drill 0.33)
  Top 0.152: v40.84,18.54 41.17,18.54 41.35,18.36 42.14,18.36 U401.31 | J701.2 22.15,26.54 22.15,24.77 v25.91,21.08
  Bottom 0.152: v40.84,18.54 28.37,18.54 v25.91,21.08
GND  (via drill 0.33)
  Top 0.152: 31.88,55.63 C120.1 31.93,55.58 | C701.2 15.24,28.35 | J701.GND1 16.36,30.79 | 26.54,27.18 J701.6 26.54,27.1 | 34.04,27.25 J403.5 34.09,27.2 | 38.99,22.35 C423.2 38.94,22.4 | U401.25 42.14,21.36 | C030.2 | C407.2 | U101.8 41.71,54.91 | 49.53,32.13 C010.2 49.51,32.05 | 50.8,32.13 R011.1 50.85,32.13 | C020.2 52.07,32.13 | 49.02,27.2 U401.6 49.02,27.13 | 59.21,32.44 59.21,32.59 U201.8 | C201.2 57.89,31.06 | 59.87,32.61 U201.7 59.94,32.61 | U201.8 59.28,32.61 | 60.5,32.61 U201.6 60.58,32.61 | 61.19,32.44 61.19,32.59 U201.5 61.11,32.61 | C203.2 62.54,31.19 | 49.02,12.83 C443.2 49.07,12.88 | 48.49,15.98 U401.42 48.54,16.05 | C451.2 55.12,17.4 | U401.50 53.37,18.34 | C462.1 57.23,26.44 | 57.43,24.99 Y1.2 57.4,24.92 | C461.1 | 55.86,22.76 Y1.4 55.8,22.84 | 55.8,23.32 55.8,22.91 | C451.2 55.09,17.53 | C451.2 55.09,17.32 | 59.16,32.54 U201.8
  other vias: 39.98,50.27
  pour Top (no thermals): 0.76,38.86 arc-90 38.86,76.96 arc-90 76.96,38.86 arc-90 38.86,0.76 arc-90
  pour Bottom (no thermals): 0.76,38.86 arc-90 38.86,76.96 arc-90 76.96,38.86 arc-90 38.86,0.76 arc-90
H_RST  (via drill 0.33)
  Top 0.152: v61.04,34.06 59.08,36.02 59.08,40.23 J102.10 J101.10 | U401.38 46.5,16.89 v47.32,17.7
  Bottom 0.152: J101.10 SJ2.3 | v47.32,17.7 55.96,26.34 60.17,26.34 61.04,27.2 v61.04,34.06
H_TICK  (via drill 0.33)
  Top 0.152: SJ1.3 J101.11 J102.11 | U401.39 47,14.8 v47.12,14.68
  Bottom 0.152: v47.12,14.68 48.95,16.51 52.63,16.51 63.02,26.9 63.02,43.94 J101.11
ISPCLK  (via drill 0.33)
  Top 0.152: U101.27 34.49,51.03 36.35,51.03 38.86,48.51 v38.86,46.74
  Bottom 0.152: SJ11.2 v38.86,46.74
ISPCLKC
  Bottom 0.152: SJ11.3 J101.2 J102.2
ISPDAT  (via drill 0.33)
  Top 0.152: U101.28 34.47,50.37 35.74,50.37 36.32,49.78 v36.32,46.74
  Bottom 0.152: SJ10.2 v36.32,46.74
ISPDATC
  Bottom 0.152: SJ10.3 J101.1 J102.1
M_RST  (via drill 0.33)
  Top 0.152: v46.18,25.88 47.09,24.97 47.09,20.52 45,18.43 U401.35 | J101.8 J102.8 54.1,40.13 54.1,30.02 v53.87,29.79
  Bottom 0.152: J101.8 SJ4.3 | v46.18,25.88 47.83,27.53 51.61,27.53 v53.87,29.79
M_TICK  (via drill 0.33)
  Top 0.152: 55.37,45.11 J101.9 J102.9 | 55.37,45.11 SJ3.3 | v59.69,42.67 59.08,43.28 59.08,44.45 58.42,45.11 55.37,45.11 | U401.37 46.02,16 46.02,17.37 v45.85,17.55
  Bottom 0.152: v59.69,42.67 62.71,42.67 62.71,27.03 52.98,17.3 49.71,17.3 49.23,16.82 46.58,16.82 v45.85,17.55
MCLR  (via drill 0.33)
  Top 0.152: U101.1 41.71,50.37 41.4,50.37 v41.4,46.74
  Bottom 0.152: SJ9.2 v41.4,46.74
MCLRC
  Bottom 0.152: SJ9.3 J101.3 J102.3
MISO0
  Top 0.152: J701.7 27.63,20.63 30.81,17.45 36.75,17.45 37.34,17.45 43.2,17.45 43.2,19.08 42.95,19.33 42.16,19.33 U401.29
MOSI0  (via drill 0.33)
  Top 0.152: v40.82,19.38 41.35,18.85 42.14,18.85 U401.30 | J701.3 23.24,25.02 v25.91,22.35
  Bottom 0.152: v40.82,19.38 28.88,19.38 v25.91,22.35
N$3
  Top 0.152: U201.4 61.19,28.37 61.19,29.16 61.86,29.83 C203.1
PPS  (via drill 0.33)
  Top 0.152: 34.52,25.76 v34.52,25.43 34.52,26.24 J403.6 | v50.27,17.88 50.5,17.65 U401.46
  Bottom 0.152: v34.52,25.43 38.58,21.36 42.85,21.36 47.09,17.12 49.1,17.12 49.86,17.88 v50.27,17.88
QDRAIN
  Top 0.152: R031.1 44.96,32.13 45.59,32.77 Q002.3
RESET  (via drill 0.33)
  Top 0.152: J401.3 40.13,29.79 38.58,28.25 R400.8 | v51.71,25.04 51.71,21.84 53.34,21.84 U401.57 | v52.58,26.01 52.53,26.06 v52.53,31.27
  Bottom 0.152: v51.71,25.04 52.58,25.91 v52.58,26.01 | J401.3 40.13,37.59 | 40.13,37.59 J402.3 | 40.13,37.59 49.02,37.59 49.02,34.77 v52.53,31.27
ROW00  (via drill 0.33)
  Top 0.152: 43.26,74.78 v39.47,75.03 39.52,76.94 39.55,76.96 D00.A | 43.26,74.78 46.99,74.12 | 46.99,74.12 50.62,73.08 | 50.62,73.08 54.15,71.65 | 54.15,71.65 57.48,69.88 | 57.48,69.88 60.63,67.77 | 60.63,67.77 63.52,65.33 | 63.52,65.33 66.17,62.59 | 66.17,62.59 68.5,59.61 70.05,60.71 70.1,60.71 D09.A | 43.26,74.78 43.48,76.66 43.56,76.68 D01.A | 46.99,74.12 47.42,75.97 47.47,76 D02.A | 50.62,73.08 51.26,74.88 D03.A | 54.15,71.65 54.94,73.38 55.02,73.38 D04.A | 57.48,69.88 58.47,71.5 D05.A | 60.63,67.77 61.77,69.27 61.82,69.29 D06.A | 63.52,65.33 64.82,66.73 64.87,66.7 D07.A | 66.17,62.59 67.62,63.86 D08.A | R101.8 44.74,58.71 45.72,59.69 v47.24,59.69
  Bottom 0.152: v39.47,75.03 40.97,75.03 40.97,65.96 v47.24,59.69
ROW00C
  Top 0.152: U101.14 43.09,58.84 R101.1
ROW10  (via drill 0.33)
  Top 0.152: 72.16,52.98 v70.51,56.39 72.16,57.33 D10.A | 73.46,49.43 72.16,52.98 | 74.37,45.75 73.46,49.43 | 74.91,42.01 74.37,45.75 | 75.03,38.23 74.91,42.01 | 74.78,34.44 75.03,38.23 | 74.12,30.71 74.78,34.44 | 73.08,27.08 74.12,30.71 | 73.08,27.08 71.65,23.55 73.38,22.76 73.41,22.73 D19.A | 72.16,52.98 73.91,53.75 73.97,53.72 D11.A | 73.46,49.43 75.29,49.99 D12.A | 74.37,45.75 76.25,46.13 D13.A | 74.91,42.01 76.81,42.16 76.84,42.16 D14.A | 75.03,38.23 76.94,38.18 76.96,38.18 D15.A | 74.78,34.44 76.66,34.21 D16.A | 74.12,30.71 75.97,30.28 76,30.28 D17.A | 73.08,27.08 74.88,26.44 D18.A | v47.75,58.93 47.62,58.8 45.95,58.8 45.31,58.16 R101.7
  Bottom 0.152: v70.51,56.39 70.36,56.24 61.57,56.24 58.88,58.93 v47.75,58.93
ROW10C
  Top 0.152: U101.13 43.19,58.19 R101.2
ROW20  (via drill 0.33)
  Top 0.152: 67.77,17.07 v69.88,20.22 71.5,19.23 71.53,19.2 D20.A | 65.33,14.17 67.77,17.07 | 62.59,11.53 65.33,14.17 | 59.61,9.2 62.59,11.53 | 56.39,7.19 59.61,9.2 | 52.98,5.54 56.39,7.19 | 49.43,4.24 52.98,5.54 | 45.75,3.33 49.43,4.24 | 45.75,3.33 42.01,2.79 42.16,0.89 D29.A | 67.77,17.07 69.27,15.93 69.29,15.9 D21.A | 65.33,14.17 66.72,12.88 | 66.72,12.88 66.73,12.88 | 62.59,11.53 63.85,10.1 | 63.85,10.1 63.86,10.08 | 59.61,9.2 60.7,7.66 | 60.7,7.66 60.71,7.65 | 56.39,7.19 57.33,5.54 57.33,5.51 D25.A | 52.98,5.54 53.74,3.79 | 53.74,3.79 53.75,3.79 | 49.43,4.24 49.98,2.42 | 49.98,2.42 49.99,2.41 | 45.75,3.33 46.12,1.48 | 46.12,1.48 46.13,1.45 | 46.12,1.48 46.1,1.47 D28.A | D27.A 49.98,2.42 | D26.A 53.72,3.79 53.74,3.79 | D24.A 60.68,7.65 60.7,7.66 | D23.A 63.85,10.1 | D22.A 66.7,12.85 66.72,12.88 | v48.26,58.17 48.11,58.01 45.95,58.01 45.6,57.66 R101.6
  Bottom 0.152: v69.88,20.22 63.42,26.67 63.42,30.91 69.6,37.08 69.6,47.24 58.67,58.17 v48.26,58.17
ROW20C
  Top 0.152: U101.12 42.55,57.54 42.68,57.66 R101.3
ROW30  (via drill 0.33)
  Top 0.152: 34.44,2.92 v38.23,2.67 38.18,0.76 D30.A | 30.71,3.58 34.44,2.92 | 27.08,4.62 30.71,3.58 | 23.55,6.05 27.08,4.62 | 20.22,7.82 23.55,6.05 | 17.07,9.93 20.22,7.82 | 14.17,12.37 17.07,9.93 | 11.53,15.11 14.17,12.37 | 11.53,15.11 9.2,18.09 7.65,17 | 34.44,2.92 34.21,1.04 D31.A | 30.71,3.58 30.28,1.75 | 30.28,1.75 30.28,1.73 | 27.08,4.62 26.45,2.83 | 26.45,2.83 26.44,2.82 | 23.55,6.05 22.76,4.33 | 22.76,4.33 22.76,4.32 | 20.22,7.82 19.24,6.22 | 19.24,6.22 19.23,6.2 | 17.07,9.93 15.93,8.44 | 15.93,8.44 15.93,8.43 | 14.17,12.37 12.89,10.99 | 12.89,10.99 12.88,10.97 | 11.53,15.11 10.11,13.87 | 10.11,13.87 10.08,13.84 | 7.65,17 7.65,16.99 | D39.A 7.62,17.04 7.65,17 | 10.11,13.87 D38.A | D37.A 12.85,11.02 12.89,10.99 | D36.A 15.93,8.44 | D35.A 19.23,6.22 19.24,6.22 | D34.A 22.76,4.33 | D33.A 26.45,2.83 | D32.A 30.28,1.75 | v47.24,55.37 45.97,55.37 45.47,55.88 R102.7
  Bottom 0.152: v47.24,55.37 40.39,62.23 18.03,62.23 12.7,56.9 12.7,41.4 14.48,39.62 14.48,27.69 38.23,3.94 v38.23,2.67
ROW30C
  Top 0.152: U101.9 42.63,55.59 42.92,55.88 R102.2
ROW40  (via drill 0.33)
  Top 0.152: 5.54,24.71 v7.19,21.31 5.56,20.38 | 5.54,24.71 4.24,28.27 | 4.24,28.27 3.33,31.95 | 3.33,31.95 2.79,35.69 | 2.79,35.69 2.67,39.47 | 2.67,39.47 2.92,43.26 | 2.92,43.26 3.58,46.99 | 3.58,46.99 4.62,50.62 | 4.62,50.62 6.05,54.15 4.32,54.94 | 5.56,20.38 5.54,20.37 | 5.54,24.71 3.81,23.96 | 3.81,23.96 3.79,23.95 | 4.24,28.27 2.43,27.72 | 2.43,27.72 2.41,27.71 | 3.33,31.95 1.46,31.57 | 1.46,31.57 1.45,31.57 | 2.79,35.69 0.92,35.54 | 0.92,35.54 0.89,35.54 | 2.67,39.47 0.76,39.52 D45.A | 2.92,43.26 1.04,43.48 D46.A | 3.58,46.99 1.74,47.42 | 1.74,47.42 1.73,47.42 | 4.62,50.62 2.83,51.26 | 2.83,51.26 2.82,51.26 | 4.32,54.94 | D40.A 5.54,20.42 5.56,20.38 | 3.81,23.96 3.79,24.03 D41.A | D42.A 2.43,27.72 | D43.A 1.46,31.57 | D44.A 0.91,35.59 0.92,35.54 | D47.A 1.75,47.47 1.74,47.42 | D48.A 2.83,51.26 | D49.A 4.34,54.99 4.32,54.94 | 47.71,56.17 arc-90 v47.75,56.13 47.46,56.43 R102.8
  Bottom 0.152: v47.75,56.13 41.15,62.74 17.78,62.74 12.19,57.15 12.19,42.16 8.64,38.61 8.64,22.76 v7.19,21.31
ROW40C
  Top 0.152: U101.10 42.52,56.23 42.67,56.39 43.18,56.39 R102.1
ROW50  (via drill 0.33)
  Top 0.152: 9.93,60.63 v7.82,57.48 6.2,58.47 D50.A | 9.93,60.63 12.37,63.52 | 12.37,63.52 15.11,66.17 | 15.11,66.17 18.09,68.5 | 18.09,68.5 21.31,70.51 | 21.31,70.51 24.71,72.16 | 24.71,72.16 28.27,73.46 | 28.27,73.46 31.95,74.37 | 31.95,74.37 35.69,74.91 35.54,76.81 35.59,76.84 D59.A | 9.93,60.63 8.43,61.77 8.43,61.8 D51.A | 12.37,63.52 10.98,64.82 | 10.98,64.82 10.97,64.82 | 15.11,66.17 13.85,67.6 | 13.85,67.6 13.84,67.62 | 18.09,68.5 16.99,70.05 17.04,70.1 D54.A | 21.31,70.51 20.37,72.16 D55.A | 24.71,72.16 23.95,73.91 24,73.97 D56.A | 28.27,73.46 27.71,75.29 D57.A | 31.95,74.37 31.57,76.25 D58.A | D52.A 11.02,64.87 10.98,64.82 | D53.A 13.85,67.6 | v48.26,57.15 45.96,57.15 45.92,57.11 R101.5
  Bottom 0.152: v48.26,57.15 42.16,63.25 17.53,63.25 11.76,57.48 v7.82,57.48
ROW50C
  Top 0.152: U101.11 42.66,56.88 42.89,57.11 R101.4
RX0  (via drill 0.33)
  Top 0.152: J403.4 34.04,28.22 35.71,28.22 35.92,28.02 v36.55,28.02 36.83,28.3 36.83,35.56 J401.2 J402.2 | v43.46,23.34 42.16,23.34 U401.21
  Bottom 0.152: v43.46,23.34 41.76,25.04 39.52,25.04 v36.55,28.02
RX1  (via drill 0.33)
  Top 0.152: 44.53,16 U401.34 44.5,18.75 v46.51,20.75
  Bottom 0.152: v46.51,20.75 47.75,22 51.18,22 55.83,26.64 60.05,26.64 60.45,27.05 J401.11 J402.11
S_RST  (via drill 0.33)
  Top 0.152: U401.47 51,17.78 v51.11,17.88
  Bottom 0.152: SJ6.3 J101.6 47.75,42.67 | v51.11,17.88 56.52,23.29 58.55,23.29 61.62,26.37 61.62,40.23 54.86,40.23 54.1,41 54.1,42.67 47.75,42.67 | 47.75,42.67 J102.6
S_TICK  (via drill 0.33)
  Top 0.152: SJ5.3 J101.7 J102.7 | v51.13,23.14 51.13,19.86 53.34,19.86 U401.53 | v54.63,26.64 56.59,28.6 v56.59,33.02
  Bottom 0.152: v51.13,23.14 v54.63,26.64 | J102.7 51.56,40.13 54.1,40.13 54.1,35.51 v56.59,33.02
SCK0  (via drill 0.33)
  Top 0.152: v40.84,20.78 41.27,20.35 42.14,20.35 U401.27 | J701.5 25.45,26.95 25.45,24.08 v25.91,23.62
  Bottom 0.152: v40.84,20.78 28.75,20.78 v25.91,23.62
T_RST
  Bottom 0.152: SJ8.3 J101.4 J102.4
T_TICK
  Top 0.152: SJ7.3 J101.5 J102.5
TX0  (via drill 0.33)
  Top 0.152: 35.92,29.26 34.04,29.26 J403.3 | 35.92,29.26 35.92,35.46 J401.1 J402.1 | v42.88,28.42 43.2,28.09 43.2,24.36 42.16,24.36 U401.19 | 35.92,29.26 35.92,28.83 v36.04,28.7
  Bottom 0.152: v42.88,28.42 42.6,28.7 v36.04,28.7
TX1  (via drill 0.33)
  Top 0.152: v53.77,26.59 56.01,28.83 v56.01,34.42 | 44.02,16 U401.33 44,20.66 v46.51,23.17
  Bottom 0.152: v46.51,23.17 48.64,25.3 51.05,25.3 52.35,26.59 v53.77,26.59 | v56.01,34.42 J401.10 J402.10
USB_ON  (via drill 0.33)
  Top 0.152: v38.96,30.43 37.13,28.6 37.13,27.2 37.62,27.2 R400.3 | v49.76,30.23 51.99,27.99 51.99,25.58 52.3,25.27 52.3,22.61 52.55,22.35 53.34,22.35 U401.58
  Bottom 0.152: v38.96,30.43 40.03,31.5 48.49,31.5 v49.76,30.23
USB_SOFTCONNECT  (via drill 0.33)
  Top 0.152: v39.88,26.52 39.88,26.62 38.58,26.62 R400.5 | U401.17 42.14,25.35 42.14,25.58 v41.71,26.01 41.76,26.06 41.76,28.12 v43.59,29.95 | v48.03,30.91 48.03,31.6 Q002.1
  Bottom 0.152: v39.88,26.52 40.39,26.01 v41.71,26.01 | v48.03,30.91 47.07,29.95 v43.59,29.95
USBCONN_D+
  Top 0.152: R030.2 43.69,33.43 44.96,33.43 R031.2 45.01,33.48 45.21,33.68 J401.5 J402.5
USBCONN_D-
  Top 0.152: 53.34,33.43 R020.2 53.34,34.29 52.32,34.29 J401.7 J402.7
USBD+
  Top 0.152: C030.1 42.42,32.13 43.69,32.13 R030.1 43.71,32.05 46.51,29.26 46.51,28.42 46.71,28.22 46.99,28.22 46.99,27.2 U401.10
USBD-  (via drill 0.33)
  Top 0.152: C020.1 53.34,32.13 R020.1 53.32,32.05 53.32,30.86 v53.11,30.66 | U401.11 46.5,27.97 v45.92,28.55
  Bottom 0.152: v45.92,28.55 47.02,29.64 52.09,29.64 v53.11,30.66
VBUS  (via drill 0.33)
  Top 0.152: 34.49,55.6 U101.20 33.16,55.59 C120.2 33.33,55.63 v33.33,48.62 33.33,33.38 35.33,31.37 v35.33,30.23 34.04,30.23 J403.2 | R011.2 50.8,33.43 49.53,33.43 C010.1 49.48,33.48 49.48,34.34 49.02,34.8 49.02,39.37 49.78,40.13 51.56,40.13 J402.8 | v40.54,27.1 39.12,27.1 39.04,27.18 R400.6 | C201.1 v57.91,28.96 58.5,28.37 U201.1 U201.2
  Bottom 0.152: SJ9.1 39.14,48.62 v33.33,48.62 | v40.54,27.1 41.27,27.84 43.46,27.84 | 43.46,27.84 51.11,27.84 53.65,30.38 55.37,30.38 | v35.33,30.23 36.55,29.01 43.1,29.01 43.46,28.65 43.46,27.84 | J402.8 J401.8 55.37,33.78 55.37,30.38 | 55.37,30.38 56.49,30.38 v57.91,28.96
VCC  (via drill 0.33)
  Top 0.152: C701.1 15.24,27.05 | C701.1 15.29,27.1 | U201.3 60.53,28.35 60.53,27.23 | C443.1 49.02,15.98 U401.43 49,17.46 50.42,18.87 50.55,18.87 | C451.1 55.12,18.69 54.28,18.69 54.15,18.82 53.37,18.82 U401.51 53.29,18.87 52.3,18.87 | 50.55,25.88 50.55,27.15 50.52,27.18 U401.3 | U401.49 53.34,17.86 52.3,17.86 52.3,18.87 | v53.16,27.18 53.16,26.01 53.98,26.01 54.38,25.6 54.38,24.84 53.37,24.84 U401.63 | v50.6,25.88 50.55,25.88 | C701.1 15.37,27.1 17.09,28.83 24.33,28.83 | 37.64,26.62 R400.4 37.62,26 v40.31,23.32 40.31,22.35 | U401.23 42.16,22.35 40.31,22.35 | R400.2 37.64,27.69 37.64,28.22 R400.1 37.64,28.3 39.55,30.2 v39.55,31.83 | J402.6 J401.6 47.75,34.21 48.23,33.73 Q002.2 48.21,33.66 47.45,32.89 47.45,29.92 48.36,29.01 C407.1 48.49,28.88 48.49,27.2 U401.7 48.51,27.13 v48.51,25.88 | v59.82,27.23 60.53,27.23 | C202.A 64.52,27.69 64.06,27.23 60.53,27.23 | 50.55,18.87 52.3,18.87 | 50.55,25.88 50.55,18.87 | 24.33,28.83 J701.4 | 24.33,28.83 v25.2,28.83 | 40.31,22.35 C423.1
  Bottom 0.152: v59.82,27.23 53.21,27.23 v53.16,27.18 52.88,26.9 51.61,26.9 v50.6,25.88 v48.51,25.88 | J401.6 46.58,35.15 42.88,35.15 v39.55,31.83 39.5,31.77 34.75,31.77 34.75,28.88 | 34.75,28.88 v40.31,23.32 | v25.2,28.83 34.7,28.83 34.75,28.88
XTAL1
  Top 0.152: C462.2 55.86,26.29 55.86,24.99 Y1.3 | 55.78,24.36 55.78,24.94 Y1.3 | 53.37,24.36 U401.62 55.84,24.34 Y1.3
XTAL2
  Top 0.152: C461.2 57.43,21.46 57.43,22.76 Y1.1 57.44,23.84 U401.61 53.37,23.83

### Text on the board
tPlace: Project Precision | 03 Oct 2011 | hour | St Kwan's Home for | minute | second | third | the Terminally ADD | TICK | a division of | Kwan Systems
bPlace: ICSP | hour | minute | second | third | Run | Program | RESET